# EAGLE board UltimateTester_v1_with_mods (EAGLE 9.6.2)
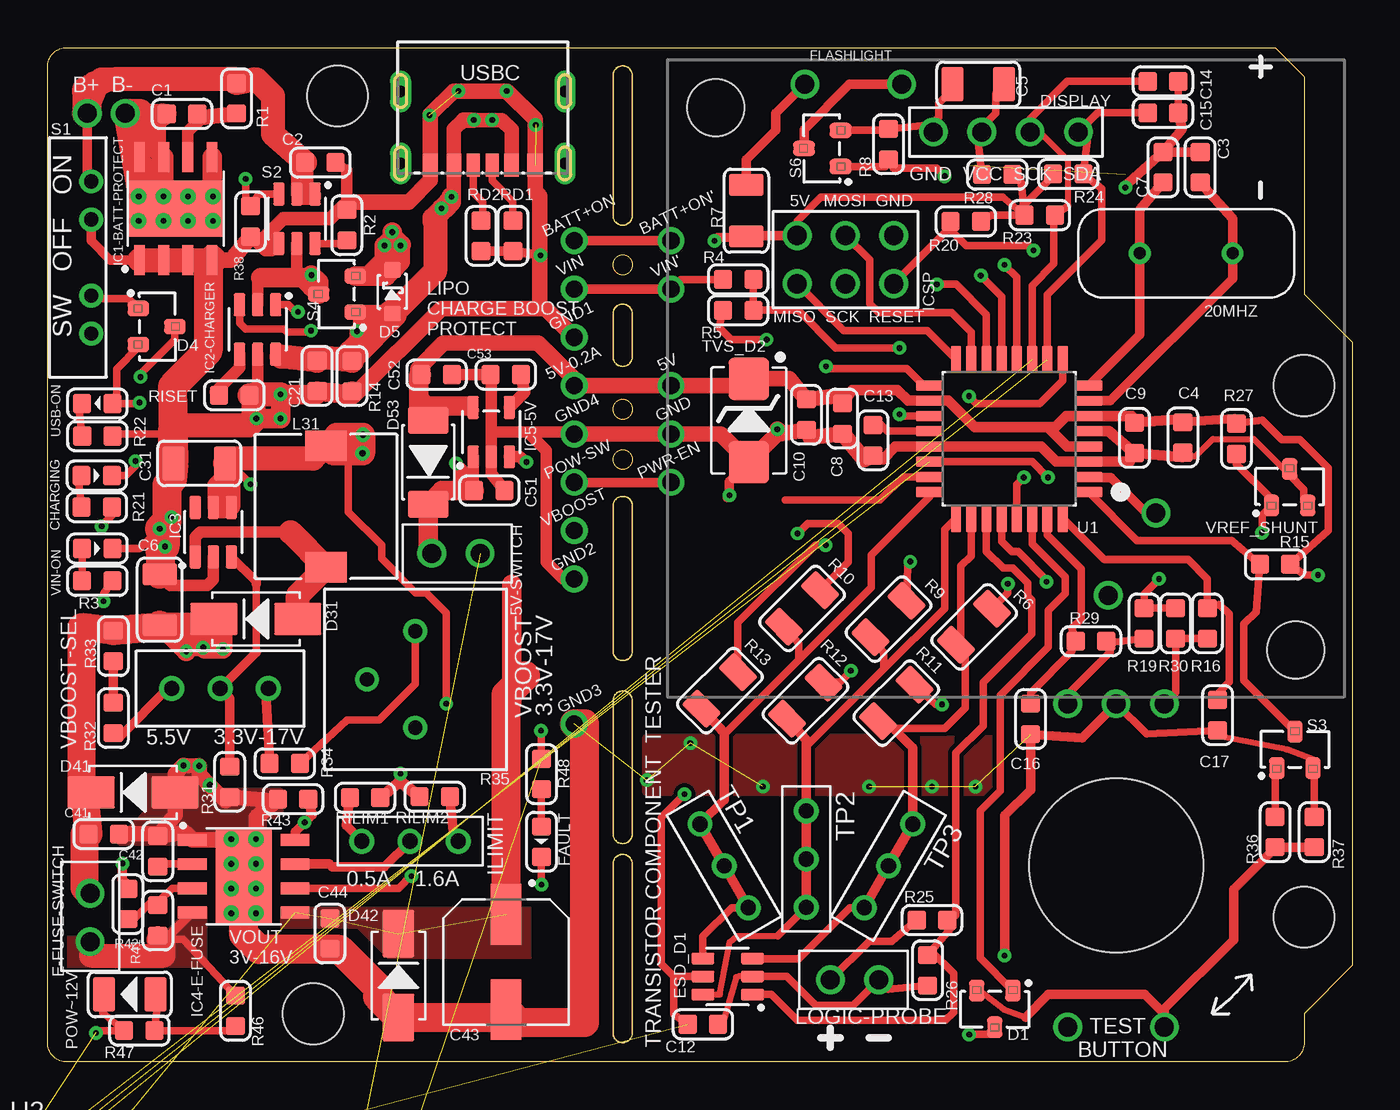
[diagram p1: board, top side]
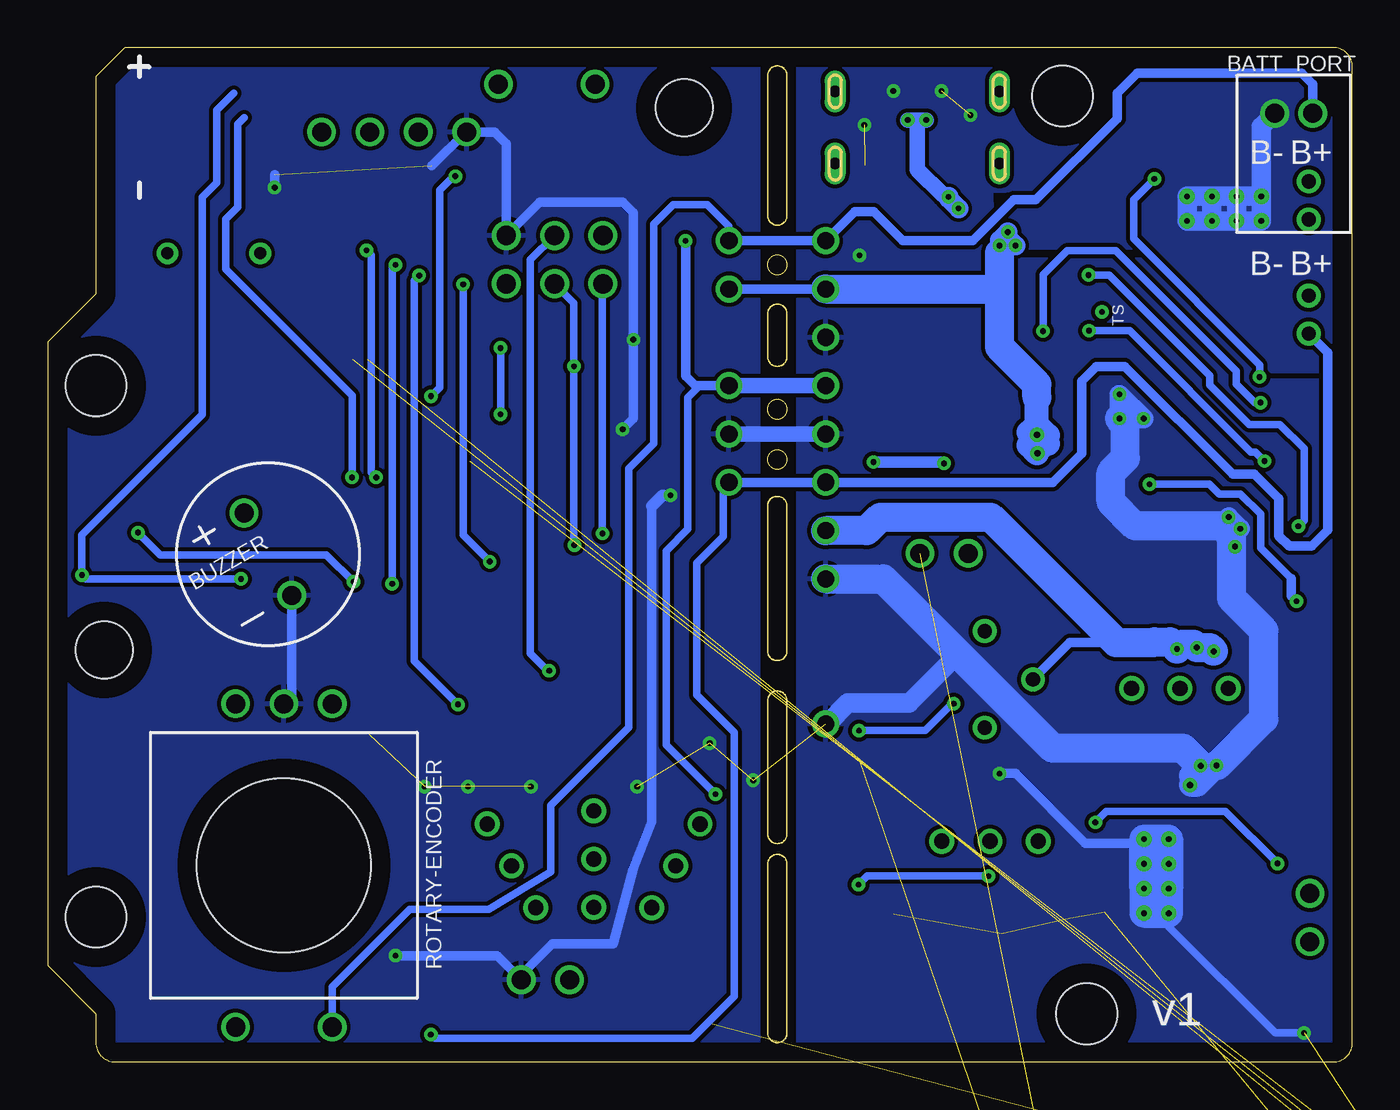
[diagram p2: board, bottom side, seen from below]

Size 68.58 x 53.34 mm. Coordinates in mm from the lower left corner, seen from the top.
Outline: 68.58,5.08 66.04,2.54 66.04,1.02 arc-90 65.02,0 1.02,0 arc-90 0,1.02 0,52.32 arc-90 1.02,53.34 64.52,53.34 66.04,51.82 66.04,40.39 68.58,37.85 68.58,5.08
Copper layers (1*16): Top 0.035mm / dielectric 1.5mm / Bottom 0.035mm
Design rules "default *": minimum track width 6mil, minimum drill 0.3mm, track to track 0.2mm, track to pad 0.2mm, pad to pad 0.2mm, via to via 10mil, smd to smd 0.2mm, copper to edge 40mil, drill to drill 0.5mm, minimum pad ring 10mil, minimum via ring 8mil, stop-mask expansion 4mil, vias tented up to drill 0mil, thermal gap 10mil
Net classes: 0 default: clearance 0.205 mm
Holes 3.2 mm at 15.24,50.8 13.97,2.54 66.04,7.62 66.04,35.56
tKeepout: area 13.2,48.8 to 17.2,52.8; area 12,0.5 to 16,4.5; area 64,5.6 to 68,9.6; area 64,33.6 to 68,37.6
bKeepout: area 13.2,48.8 to 17.2,52.8; area 12,0.5 to 16,4.5; area 64,5.6 to 68,9.6; area 64,33.6 to 68,37.6
Milling: area 29.7,33.8 to 30.7,34.8; area 29.7,31.2 to 30.7,32.2; area 29.7,41.4 to 30.7,42.4; 30 lines

## Footprints (pad centres in the part's own frame; a part is rotated, then mirrored left to right if it is on the bottom)
TEST-POINT-TH-1MM = drill 0.9: P$1 0,0
HEADER-2PIN-0.1"P = drill 1: 1 -1.27,0; 2 1.27,0
XTAL_ECS-200-18-4X-CKM = drill 0.63 pad 1.03: 1 -2.44,0; 2 2.44,0
S2B-PH-K-S = drill 1: N 0.984,-2.54; P -1.016,-2.54
BUZZER-ACTIVE-CMI-9605-0580T = drill 1: P$1 0,2.5; P$2 0,-2.5
0603 = smd 0.95 x 1: 1 -0.8,0; 2 0.8,0
1206 = smd 1.15 x 1.8: 1 -1.35,0; 2 1.35,0
CAP_EEEFN1E101UP = smd 3.2 x 1.6: 1 -2.5,0; 2 2.5,0
0603-DIODE = smd 0.95 x 1: A 0.8,0; C -0.8,0
SOT-23-3 = smd 0.8 x 1.13: 1 -0.95,-0.96; 2 0.95,-0.96; 3 0,0.96
SMA = smd 2.5 x 1.7: A -2.205,0; C 2.205,0
SOD-323 = smd 0.8 x 0.9: A -1.16,-0.03; C 1.14,-0.03
SOD-128 = smd 1.4 x 2.1: A -2.11,-0.06; K 2.29,-0.06
DISPLAY-1.3"-SH1106-I2C = drill 1: GND -3.81,-1.27; SCK 1.27,-1.27; SDA 3.81,-1.27; VCC -1.27,-1.27 | hole 3: -15.24,0; 15.24,-28.5
SOT-23-6 = smd 1.2 x 0.6: 1 -1.3,0.95; 2 -1.3,0; 3 -1.3,-0.95; 4 1.3,-0.95; 5 1.3,0; 6 1.3,0.95
HEADER-2PIN-0.2"P = drill 1: 1 -2.54,0; 2 2.54,0
SOIC-8-POWER-PAD = smd 1.55 x 0.6: 1 -2.7,1.905; 2 -2.7,0.635; 3 -2.7,-0.635; 4 -2.7,-1.905; 5 2.7,-1.905; 6 2.7,-0.635; 7 2.7,0.635; 8 2.7,1.905 | smd 2.95 x 4.9: 9 0,0 | drill 0.3: 10 -0.65,1.95; 11 0.65,1.95; 12 -0.65,0.65; 13 0.65,0.65; 14 -0.65,-0.65; 15 0.65,-0.65; 16 -0.65,-1.95; 17 0.65,-1.95
SOT-23-5 = smd 1.2 x 0.6: 1 -1.3,0.95; 2 -1.3,0; 3 -1.3,-0.95; 4 1.3,-0.95; 5 1.3,0.95
HEADER-ICSP-0.1"P = drill 1.016: GND 2.54,1.27; MISO -2.54,-1.27; MOSI 0,1.27; RESET 2.54,-1.27; SCK 0,-1.27; VCC -2.54,1.27
HEADER-3PIN-0.1"P = drill 0.8: 1 -2.54,0; 2 0,0; 3 2.54,0
AMPHENOL_87583-2010RLF = smd 1.12 x 2.88: 01 -3.5,3.58; 02 -1,3.58; 03 1,3.58; 04 3.5,3.58 | drill 2.36: S1 -6.57,0; S2 6.57,0
INDUCTOR-SMRH74-220MT = smd 2.2 x 1.6: P$1 0,3.2; P$2 0,-3.2
1206-DIODE = smd 1.15 x 1.8: A1 1.35,0; C1 -1.35,0
ROTARY-POTENTIOMETER-3386P = drill 0.75: 1 2.54,0; 2 0,-2.54; 3 -2.54,0
PEC12R-3217F-S0024 = drill 1: 1 -2.54,8.5; 2 2.54,8.5; A -2.54,-8.5; B 2.54,-8.5; C 0,-8.5 | hole 9.144: 0,0
CSS-1310MC = drill 0.75: 1 -4,0; 2 -2,0; 3 4,0; C 2,0
DIOM5336X244N = smd 2.22 x 2.13: A 2.19,0; C -2.19,0
TQFP32 = smd 1.47 x 0.55: 1 -4.17,2.8; 2 -4.17,2; 3 -4.17,1.2; 4 -4.17,0.4; 5 -4.17,-0.4; 6 -4.17,-1.2; 7 -4.17,-2; 8 -4.17,-2.8; 17 4.17,-2.8; 18 4.17,-2; 19 4.17,-1.2; 20 4.17,-0.4; 21 4.17,0.4; 22 4.17,1.2; 23 4.17,2; 24 4.17,2.8 | smd 0.55 x 1.47: 9 -2.8,-4.17; 10 -2,-4.17; 11 -1.2,-4.17; 12 -0.4,-4.17; 13 0.4,-4.17; 14 1.2,-4.17; 15 2,-4.17; 16 2.8,-4.17; 25 2.8,4.17; 26 2,4.17; 27 1.2,4.17; 28 0.4,4.17; 29 -0.4,4.17; 30 -1.2,4.17; 31 -2,4.17; 32 -2.8,4.17
SOP50P490X110-10N = smd 1.47 x 0.28: 1 -2.15,1; 2 -2.15,0.5; 3 -2.15,0; 4 -2.15,-0.5; 5 -2.15,-1; 6 2.15,-1; 7 2.15,-0.5; 8 2.15,0; 9 2.15,0.5; 10 2.15,1
USB-C-RECEPTABLE-1016435900011LF = smd 0.7 x 1.2: A5 -0.5,3.03; B5 0.5,3.03 | smd 0.76 x 1.2: A9 1.52,3.03; B9 -1.52,3.03 | smd 0.8 x 1.2: A12 2.75,3.03; B12 -2.75,3.03 | drill 0.6 pad 1.1 long: SH1 -4.32,2.95; SH2 4.32,2.95; SH3 -4.32,-0.85; SH4 4.32,-0.85
SLW-883935-2A-D = drill 0.8: 1 -2.54,0; 2 2.54,0; C 0,0

## Placement (x,y rotation side)
5V  TEST-POINT-TH  [TEST-POINT-TH-1MM]  32.77,35.56 0 top
5V-0.2A  TEST-POINT-TH  [TEST-POINT-TH-1MM]  27.69,35.56 70 top
5V-SWITCH  [HEADER-2PIN-0.1"P]  21.46,26.75 180 top
20MHZ  ECS-200-18-4X-CKM  [XTAL_ECS-200-18-4X-CKM]  59.84,42.52 0 top
BATT+ON  TEST-POINT-TH  [TEST-POINT-TH-1MM]  27.69,43.18 70 top
BATT+ON'  TEST-POINT-TH  [TEST-POINT-TH-1MM]  32.77,43.18 0 top
BATT_PORT  S2B-PH-K-S  [S2B-PH-K-S]  3.1,47.34 180 bottom
BUZZER  CMI-9605-0580T  [BUZZER-ACTIVE-CMI-9605-0580T]  57,26.7 30 bottom
C1  0.1uF  [0603]  7.07,49.85 180 top
C2  1uF  [0603]  14.33,47.29 180 top
C3  22pF  [0603]  60.58,47.04 270 top
C4  10uF  [0603]  59.66,32.84 270 top
C5  10uF  [1206]  48.92,51.41 180 top
C6  22uF-35V  [1206]  5.89,24.31 270 top
C7  22pF  [0603]  58.62,47.04 270 top
C8  100nF  [0603]  41.78,33.83 90 top
C9  100nF  [0603]  57.12,32.82 270 top
C10  10uF  [0603]  39.88,34.04 270 top
C11  22uF-15V  [1206]  -1.35,-118.03 0 top  (outside the outline)
C12  10uF  [0603]  34.44,1.98 0 top
C13  1nF  [0603]  43.38,32.69 270 top
C14  NC/10pF  [0603]  58.62,51.56 180 top
C15  NC/10pF  [0603]  58.62,49.91 180 top
C16  100nF  [0603]  51.66,18.03 270 top
C17  100nF  [0603]  61.49,18.24 270 top
C18  22uF-35V  [1206]  -1.35,-130.73 0 top  (outside the outline)
C21  1uF  [0603]  14.17,36.08 90 top
C31  22uF-15V  [1206]  7.98,31.47 0 top
C41  0.1uF  [0603]  2.95,11.99 180 top
C42  10nF  [0603]  5.79,11.07 270 top
C43  100uF  [CAP_EEEFN1E101UP]  24.1,5.26 270 top
C44  10uF  [0603]  14.83,6.76 90 top
C51  10uF-25V  [0603]  23.22,30.05 180 top
C52  10uF  [0603]  20.45,36.14 180 top
C53  10nFC0G  [0603]  24.08,36.14 0 top
CHARGING  BLUE  [0603-DIODE]  2.59,30.84 180 top
D1  PMBD6100,215  [SOT-23-3]  49.78,2.79 180 top
D2  SS34  [SMA]  -2.21,-143.43 0 top  (outside the outline)
D4  PMBD6100,215  [SOT-23-3]  5.73,38.67 270 top
D5  CUS10S30  [SOD-323]  18.09,40.51 90 top
D31  SS34  [SMA]  10.95,23.29 180 top
D41  SMAJ15A  [SMA]  4.5,14.17 180 top
D42  SS34  [SMA]  18.44,4.55 90 top
D53  PMEG3010EP  [SOD-128]  20.07,31.62 270 top
DISPLAY  [DISPLAY-1.3"-SH1106-I2C]  50.37,50.16 0 top
E-FUSE-SWITCH  [HEADER-2PIN-0.1"P]  2.24,7.59 270 top
ESD_D1  SRV05-4MR6  [SOT-23-6]  35.74,4.5 180 top
FAULT  RED  [0603-DIODE]  25.96,11.58 90 top
FLASHLIGHT  HEADER-2PIN-0.2"P  [HEADER-2PIN-0.2"P]  42.34,51.41 0 top
GND  TEST-POINT-TH  [TEST-POINT-TH-1MM]  32.77,33.02 0 top
GND1  TEST-POINT-TH  [TEST-POINT-TH-1MM]  27.69,38.1 70 top
GND2  TEST-POINT-TH  [TEST-POINT-TH-1MM]  27.69,25.4 70 top
GND3  TEST-POINT-TH  [TEST-POINT-TH-1MM]  27.69,17.78 70 top
GND4  TEST-POINT-TH  [TEST-POINT-TH-1MM]  27.69,33.02 70 top
IC1  MT3608  [SOT-23-6]  -1.3,-59.88 0 top  (outside the outline)
IC1-BATT-PROTECT  XB8089D  [SOIC-8-POWER-PAD]  6.74,44.87 90 top
IC2-CHARGER  BQ21040DB  [SOT-23-6]  11.04,38.52 270 top
IC3  MT3608  [SOT-23-6]  8.71,27.86 90 top
IC4-E-FUSE  TPS259630  [SOIC-8-POWER-PAD]  10.3,9.77 0 top
IC5-5V  LP2992IM5-5.0  [SOT-23-5]  23.32,33.12 90 top
ICSP  CES-103-01-T-D  [HEADER-ICSP-0.1"P]  41.94,42.19 0 top
ILIMIT  [HEADER-3PIN-0.1"P]  19.05,11.61 0 top
J1  USB-A-RECEPTABLE  [AMPHENOL_87583-2010RLF]  -14.99,-135.64 0 top  (outside the outline)
L1  22uH  [INDUCTOR-SMRH74-220MT]  0,-76.73 0 top  (outside the outline)
L31  22uH  [INDUCTOR-SMRH74-220MT]  14.63,29.21 0 top
LOGIC-PROBE  [HEADER-2PIN-0.1"P]  42.42,4.32 0 top
POW-SW  TEST-POINT-TH  [TEST-POINT-TH-1MM]  27.69,30.48 70 top
POW~12V  RED  [1206-DIODE]  4.32,3.56 0 top
PWR-EN  TEST-POINT-TH  [TEST-POINT-TH-1MM]  32.77,30.48 0 top
R1  1K  [0603]  9.94,50.67 90 top
R2  10K  [0603]  15.73,44 90 top
R3  4K7  [0603]  2.62,25.3 0 top
R4  10K  [0603]  36.3,41.15 0 top
R5  3K3  [0603]  36.3,39.52 180 top
R6  680  [1206]  48.69,22.89 225 top
R7  51  [1206]  36.73,44.75 90 top
R8  100K  [0603]  44.2,48.26 90 top
R9  680  [1206]  44.2,23.29 225 top
R10  680  [1206]  39.65,23.85 225 top
R11  470k  [1206]  44.6,18.87 225 top
R12  470k  [1206]  39.83,19 225 top
R13  470k  [1206]  35.33,19.53 225 top
R14  10K  [0603]  16,36.07 90 top
R15  100K  [0603]  64.52,26.16 180 top
R16  10K  [0603]  60.96,23.06 90 top
R17  20K  [0603]  -0.8,-92.63 0 top  (outside the outline)
R18  2.2K  [0603]  -0.8,-105.33 0 top  (outside the outline)
R19  10K  [0603]  57.63,23.06 90 top
R20  10K  [0603]  48.26,44.2 180 top
R21  1K  [0603]  2.59,29.18 0 top
R22  750  [0603]  2.62,32.91 180 top
R23  3.3K  [0603]  52.15,44.53 180 top
R24  3.3K  [0603]  53.64,46.69 180 top
R25  10K  [0603]  46.48,7.47 180 top
R26  3.3K  [0603]  46.25,4.83 90 top
R27  10K  [0603]  62.48,32.77 270 top
R28  68R  [0603]  49.91,46.66 0 top
R29  10K  [0603]  54.84,22.12 180 top
R30  10K  [0603]  59.28,23.06 90 top
R31  2.2K  [0603]  9.58,14.73 270 top
R32  18K  [0603]  3.45,18.08 270 top
R33  0  [0603]  3.45,21.87 270 top
R34  10K-1%  [0603]  12.47,15.7 180 top
R35  50K  [ROTARY-POTENTIOMETER-3386P]  19.33,20.12 270 top
R36  10K  [0603]  64.52,12.09 270 top
R37  22K  [0603]  66.57,12.09 270 top
R38  7K5  [0603]  10.67,44.2 90 top
R41  82K5  [0603]  5.79,7.44 270 top
R42  38K3  [0603]  4.22,8.31 270 top
R43  10K  [0603]  12.9,13.82 0 top
R46  3K3  [0603]  9.88,2.69 90 top
R47  1K  [0603]  4.83,1.65 0 top
R48  470  [0603]  25.96,15.14 90 top
RD1  5K1-1%  [0603]  24.46,43.43 90 top
RD2  5K1-1%  [0603]  22.78,43.43 90 top
RILIM1  1K8-1%  [0603]  16.69,13.89 180 top
RILIM2  560-1%  [0603]  20.35,13.94 0 top
RISET  1K5-0.36A  [0603]  9.81,35.06 0 top
ROTARY-ENCODER  PEC12R-3217F-S0024  [PEC12R-3217F-S0024]  56.16,10.34 180 top
S1  POWER-SWITCH  [CSS-1310MC]  2.29,42.3 270 top
S2  TPS22995H  [SOT-23-6]  13.11,44.34 270 top
S3  BC847C  [SOT-23-3]  65.56,16.41 0 top
S4  DMP1045U  [SOT-23-3]  15.21,40.38 90 top
S6  AS2312  [SOT-23-3]  40.72,48.03 90 top
TP1  [HEADER-3PIN-0.1"P]  35.56,10.31 300 top
TP2  [HEADER-3PIN-0.1"P]  39.88,10.67 270 top
TP3  [HEADER-3PIN-0.1"P]  44.2,10.31 240 top
TVS_D2  SMBJP6KE6.8A  [DIOM5336X244N]  36.86,33.73 270 top
U1  ATMEGA328P-AU-TQFP  [TQFP32]  50.55,32.77 180 top
U2  INA226AIDGST  [SOP50P490X110-10N]  1.02,-5.08 0 top  (outside the outline)
USB-ON  ORANGE  [0603-DIODE]  2.62,34.62 0 top
USBC  10164359-00011LF  [USB-C-RECEPTABLE-1016435900011LF]  22.87,50.19 180 top
VBOOST  TEST-POINT-TH  [TEST-POINT-TH-1MM]  27.69,27.94 70 top
VBOOST-SEL  [SLW-883935-2A-D]  9.07,19.63 0 top
VIN  TEST-POINT-TH  [TEST-POINT-TH-1MM]  27.69,40.64 70 top
VIN'  TEST-POINT-TH  [TEST-POINT-TH-1MM]  32.77,40.64 0 top
VIN-ON  GREEN  [0603-DIODE]  2.62,27 180 top
VOUT  TEST-POINT-TH  [TEST-POINT-TH-1MM]  0,-46.23 0 top  (outside the outline)
VREF_SHUNT  LM4040AELT-2.5  [SOT-23-3]  65.28,30.23 0 top

## Tracks (layer width: path | path; a pad name or v marks a point on that pad's centre or on a via)
5V  (via drill 0.3)  (1 unrouted)
  Top 0.406: R23.2 51.15,44.91 52.65,46.41 R24.2 | R28.2 51.15,46.42 R23.2 | R23.2 50.21,45.47 40.64,45.47 39.4,44.22 ICSP.VCC | R30.2 R19.2 57.63,24.61 v58.42,25.4 | R27.1 63.85,33.77 64.87,32.74 65.81,32.74 67.31,31.24 67.31,27.96 R15.1 66.08,25.6 v66.77,25.6 | R20.1 49.59,44.53 R23.2 | v33.48,14.09 32.26,12.87 32.26,5.16 32.92,4.5 | ESD_D1.5 32.92,4.5 | C12.1 32.92,2.5 32.92,4.5
  Top 0.508: 59.64,33.82 C4.1 62.41,33.84 R27.1 | D53.A 20.56,34.29 | 22.37,34.29 IC5-5V.5 22.09,34.7 | C52.2 19.45,35.24 | v35.05,43.18 35.2,43.33 R7.1 36.85,43.46 ICSP.VCC
  Top 0.559: C8.2 42.29,35.34 44.67,35.34 45.24,34.77 U1.18 47.35,34.77 48.72,33.39 52.58,33.39 | 59.64,33.82 C9.1 56.98,33.97 U1.6 53.55,33.97 52.97,33.39 52.58,33.39 | 52.58,33.39 53.6,32.37 U1.4
  Top 0.61: 20.56,34.29 22.37,34.29 | 22.09,34.7 19.98,34.7 19.45,35.24
  Top 0.813: C8.2 41.58,35.04 C10.1 38.99,35.92 TVS_D2.C 36.49,35.56 5V.P$1 5V-0.2A.P$1 27.94,35.64 25.78,37.8 20.8,37.8 19.45,36.44 C52.2 | D53.A 19.5,34.24
  Top 1.016: 19.5,34.24 19.5,36.09 C52.2
  Bottom 0.406: v58.42,25.4 66.57,25.4 v66.77,25.6 66.77,27.71 60.45,34.04 60.45,45.47 59.69,46.23 59.69,50.04 58.8,50.93 | 5V.P$1 34.29,35.56 34.92,34.92 34.92,28.02 36.07,26.87 36.07,16.68 v33.48,14.09
  Bottom 0.508: v35.05,43.18 35.05,36.07 34.54,35.56 5V.P$1
  Bottom 0.813: 5V-0.2A.P$1 5V.P$1
!FLT  (via drill 0.3)
  Top 0.406: v19.13,9.78 19.1,9.78 18.46,9.13 IC4-E-FUSE.6 | FAULT.C v25.96,9.32
  Bottom 0.406: v19.13,9.78 25.5,9.78 v25.96,9.32
+VE
  Top 0.406: LOGIC-PROBE.1 43.18,6.35 44.36,6.35 R25.2
A
  Top 0.406: ROTARY-ENCODER.A 59.28,19.42 R30.1 R16.1
ADC7_(NOT_USED)  (via drill 0.3)  (1 unrouted)
  Top 0.406: U1.22 51.75,31.57 v52.58,30.73
  Bottom 0.406: v52.58,30.73 52.58,35.05 59.21,41.68 59.21,44.32 58.59,44.94 58.59,49.3 58.23,49.66
AREF
  Top 0.406: U1.20 44.14,33.17 43.61,33.69 C13.1
B
  Top 0.406: ROTARY-ENCODER.B 53.62,19.33 55.84,21.55 R29.1 55.9,22.06 R19.1
BATT+  (via drill 0.3)
  Top 0.406: v2.85,28.17 2.85,28.21 3.59,28.95 R21.2
  Top 0.61: 12.85,41.25 13.11,41.5 S2.5 13.11,41.38 v13.87,41.38 | 11.2,41.25 11.04,41.09 IC2-CHARGER.2
  Top 1.016: S4.3 13.87,40.76 v13.87,41.38 | v13.87,41.38 13.74,41.25 13.38,41.25 | 13.38,41.25 12.85,41.25 11.2,41.25 | S4.3 13.38,41.25 | v13.87,41.38 14.25,41 S4.3
  Bottom 0.406: v13.87,41.38 12.78,41.38 7.49,36.09 7.49,35.59 5.44,33.53 3.81,33.53 2.54,32.26 2.54,28.47 v2.85,28.17
BATT-
  Top 0.406: 6.1,45.53 6.74,44.9 IC1-BATT-PROTECT.9 7.43,45.56 8.64,45.56
  Top 1.016: 6.04,49.88 C1.2 | C1.2 5.71,49.5 5.71,47.96 IC1-BATT-PROTECT.7 | IC1-BATT-PROTECT.8 4.83,47.42 5.44,46.81 6.1,47.47 IC1-BATT-PROTECT.7 | 6.59,45.26 6.1,45.26 6.1,45.53 | IC1-BATT-PROTECT.7 6.1,45.53 | 6.1,45.53 IC1-BATT-PROTECT.13 | IC1-BATT-PROTECT.11 4.83,45.56 IC1-BATT-PROTECT.8 | IC1-BATT-PROTECT.8 4.83,49.88 C1.2 | IC1-BATT-PROTECT.5 8.64,45.56 IC1-BATT-PROTECT.17 | IC1-BATT-PROTECT.9 7.13,45.26
  Top 1.27: BATT_PORT.N 4.83,45.56
  Top 1.524: BATT_PORT.N 4.83,49.88
  Bottom 1.016: BATT_PORT.N 4.79,49.18 IC1-BATT-PROTECT.11 | IC1-BATT-PROTECT.11 IC1-BATT-PROTECT.13 | IC1-BATT-PROTECT.13 IC1-BATT-PROTECT.15 | IC1-BATT-PROTECT.15 IC1-BATT-PROTECT.17 IC1-BATT-PROTECT.16 IC1-BATT-PROTECT.14 | IC1-BATT-PROTECT.14 IC1-BATT-PROTECT.15 | IC1-BATT-PROTECT.14 IC1-BATT-PROTECT.12 | IC1-BATT-PROTECT.12 IC1-BATT-PROTECT.10 IC1-BATT-PROTECT.11 | IC1-BATT-PROTECT.13 IC1-BATT-PROTECT.12
  pour Bottom (no thermals): -0.2,54.15 -0.2,36.25 4.27,36.25 10.77,42.75 17.91,42.75 18.06,42.9 18.06,45.26 16.46,45.26 12.37,49.35 12.37,54.36 0,54.36
BATT_EN  (via drill 0.3)
  Top 0.406: D4.3 6.7,37.98 4.88,36.16 v4.88,36.02 | S2.3 11.11,45.64 R38.2 10.41,45.45 v10.41,46.43
  Bottom 0.406: v10.41,46.43 11.51,45.34 11.51,43.28 4.88,36.65 v4.88,36.02
BATTP_ALWAYS_ON
  Top 0.508: BATT_PORT.P 2.08,46.51 S1.1 | BATT+ON.P$1 BATT+ON'.P$1
  Top 0.61: S2.2 13.11,47.07 C2.2 | C2.2 13.64,47.29 13.69,47.24 13.69,45.85 13.9,45.64 S2.1 14.06,45.44 13.98,45.36 13.3,45.36 13.3,47.27 C2.2
  Top 1.016: 9.93,51.66 R1.2 | 3.51,51.66 2.06,51 | BATT_PORT.P 2.75,51.46 2.84,51.66
  Top 1.27: 2.06,51.08 2.44,51.46 2.75,51.46 | 2.84,51.66 3.51,51.66 9.93,51.66 | R1.2 10.97,51.67 11.84,50.8 11.84,48.78 C2.2
  Top 1.524: BATT_PORT.P 2.06,49.91 2.06,51 2.06,51.08
  Bottom 0.406: BATT+ON'.P$1 32.77,43.94 33.91,45.09 35.69,45.09 36.73,44.04 36.73,32.51 38.02,31.22 38.02,17.6 42.14,13.49 42.14,10.01 45.39,8.03 49.53,8.03 53.62,3.94 ROTARY-ENCODER.2
  Bottom 0.508: BATT_PORT.P 2.08,51.42 2.67,52 11.3,52 12.37,50.94 12.37,49.61 16.64,45.34 17.8,45.34 19.96,43.18 23.62,43.18 25.15,44.7 26.16,44.7 BATT+ON.P$1 BATT+ON'.P$1
BJT-B
  Top 0.406: R36.1 64.52,15.36 S3.1
BUZZER
  Top 0.508: U1.2 54.75,30.73 55.88,30.73 57.75,28.86 BUZZER.P$1
BYP1
  Top 0.61: IC5-5V.4 25.08,35.23 C53.2
CHG  (via drill 0.3)
  Top 0.406: IC2-CHARGER.3 10.09,38.86 10.41,38.53 12.45,38.53 12.6,38.37 13.76,38.37 v13.84,38.46 | CHARGING.C 4.1,30.84 4.62,31.36 v4.62,31.6
  Bottom 0.406: v13.84,38.46 11.71,38.46 5.33,32.08 5.11,32.08 v4.62,31.6
DISPLAY_VCC
  Top 0.406: R28.1 48.91,48.38 49.1,48.56 DISPLAY.VCC 49.1,49.15 49.84,49.89 49.84,50.9 C5.1
DVDT
  Top 0.406: C42.2 6.12,10.4 IC4-E-FUSE.2
EN/UVLO
  Top 0.406: IC4-E-FUSE.3 6.54,9.13 5.85,8.44 R41.1 5.49,8.44 4.35,7.31 R42.2
ENC_A
  Top 0.406: C17.1 61.49,19.36 62.1,19.97 62.1,23.55 61.59,24.06 R16.2 60.96,25.4 59.94,26.42 55.53,26.42 U1.32
ENC_B
  Top 0.406: U1.31 52.55,27.72 54.33,25.93 54.33,23.3 53.84,22.81 R29.2 53.84,21.58 51.66,19.41 C16.1
FB
  Top 0.406: 10.97,25.15 10.97,21.54
  Top 0.508: R31.1 9.58,19.13 VBOOST-SEL.C 10.97,21.54 | IC3.3 10.97,25.25 10.97,25.15
FB2  (2 unrouted)
FL+
  Top 0.508: FLASHLIGHT.1 38.28,49.89 38.28,48.99 36.73,47.44 R7.2
FL-
  Top 0.508: S6.3 39.76,49.03 42.14,51.41 FLASHLIGHT.2
FLASHLIGHT  (via drill 0.3)
  Top 0.305: 53.34,35.81 53.35,35.82
  Top 0.406: S6.1 44.02,47.08 R8.1 44.45,47.01 46.72,47.01 v47.15,46.58 | v48.42,35.01 48.81,34.62 52.15,34.62 53.34,35.81 | 53.35,35.82 U1.9
  Bottom 0.406: v47.15,46.58 47.24,46.58 47.97,45.85 47.97,35.47 v48.42,35.01
GND  (via drill 0.3, 0.35)  (17 unrouted)
  Top 0.305: C4.2 60.33,31.84 61.25,32.77 63.39,32.77 64.97,31.19 VREF_SHUNT.3 | ESD_D1.2 36.3,4.5 36.19,4.46 35.52,2.11 C12.2 | S3.2 66.51,15.91 65.13,16.43 61.62,17.11 C17.2
  Top 0.406: R22.1 3.72,33.01 6.21,33.01 6.55,32.66 C31.1 | C5.2 47.5,51.09 46.83,50.42 46.83,49.67 46.56,49.4 DISPLAY.GND 46.19,49.26 R8.2 43.92,48.98 S6.2 | C14.1 C15.1 | VREF_SHUNT.2 66.03,29.47 66.03,30.11 65.28,30.86 VREF_SHUNT.3 | ROTARY-ENCODER.C 57.76,17.24 C17.2 | ESD_D1.2 38.86,4.5 40.39,2.97 42.34,2.97 LOGIC-PROBE.2 44.18,3.83 R26.1 | POW~12V.C1 2.9,2.58 R47.1 2.67,1.65 v2.54,1.52 | R5.2 35.3,38.62 35.93,37.98 v37.8,37.98 | VIN-ON.C 4.85,27 v5.89,28.04 | R37.1 66.57,15.38 S3.2
  Top 0.508: S1.2 2.29,43.17 3.3,42.17 IC1-BATT-PROTECT.1 | 59.64,31.82 C4.2 | 56.87,31.57 C9.2 | v50.29,5.59 50.32,5.61 50.32,12.96 51.66,14.31 C16.2 54.37,17.03 ROTARY-ENCODER.C | 5.89,25.6 C6.1 | 15.73,46.89 C2.1 | RD1.1 25.86,42.43 | RD1.1 RD2.1 | 35.73,29.68 v35.84,29.79 35.84,30.52 TVS_D2.A | C7.1 C3.1 | C7.1 59.62,49.04 C15.1 | v56.64,45.97 56.6,46.02 C7.1 | RD1.1 25.89,42.43 v25.91,42.42
  Top 0.559: U1.5 55.77,33.17 C9.2 59.64,31.82 | 56.87,31.57 U1.3 53.02,31.57 52.22,32.37 U1.21 44.56,32.37 43.88,31.69 C13.2
  Top 0.61: IC2-CHARGER.5 11.04,35.28 10.83,35.08 | IC3.2 8.71,25.38 8.38,25.04 6.45,25.04 5.89,25.6 | C51.1 23.32,30.95 IC5-5V.2 23.32,33.12 | GND2.P$1 27.1,25.4 26.21,26.29 26.21,32.16 25.25,33.12 | RILIM1.1 18.54,14.75 | 18.54,14.75 v18.54,15.16 | RILIM2.1 18.54,14.75 | 23.32,33.12 25.25,33.12 | 25.25,33.12 27.84,33.12 GND4.P$1 | R2.2 15.73,46.89 | 23.32,33.12 23.32,35.91 C53.1 C52.1 | S2.4 12,43.2 R38.1 10.91,43.2 11.43,42.67 11.79,42.67 S2.4
  Top 0.711: R38.1 11.24,43.2 12.39,44.35 14.85,44.35 15.5,45 R2.2
  Top 0.762: 6.55,33.22 6.81,33.48
  Top 0.813: C13.2 42.93,31.69 C8.1 40.08,32.83 C10.2 38.59,33.04 v38.35,33.27 38.35,33.04 TVS_D2.A 35.38,33.02 GND.P$1 GND4.P$1 | GND1.P$1 27.71,38.1 26.19,39.62 25.86,39.62 | 25.86,39.62 25.86,42.43 25.86,45.52 25.62,45.75 USBC.B12 25.62,49.56 v24.13,51.05 v21.59,51.05 21.34,51.05 20.12,49.84 USBC.A12 20.12,46.36 18.97,45.21 15.94,45.21 R2.2 | R14.1 16.13,35.07 20.68,39.62 25.86,39.62 | IC4-E-FUSE.11 10.96,12.87 R43.1 11.82,13.73 R31.2 9.36,13.73 v8.53,14.55 7.98,15.11 v7.98,15.57 v7.14,15.6 6.7,15.16 D41.A 6.7,12.98 C42.1 | C41.1 5.71,11.99 C42.1 | C42.1 7.21,12.07 IC4-E-FUSE.1 9.61,11.68 IC4-E-FUSE.10 | IC1-BATT-PROTECT.4 9.64,42.17 R38.1
  Top 1.016: IC4-E-FUSE.9 IC4-E-FUSE.14 | 10.3,8.47 IC4-E-FUSE.16 | 11.1,5.92 11.26,5.76 C44.1 14.99,5.92 15.37,5.92 | v10.97,33.83 v12.24,33.83 v12.24,35.1 14.15,35.1 C21.1 15.99,35.08 R14.1
  Top 1.27: IC1-BATT-PROTECT.1 IC1-BATT-PROTECT.2 IC1-BATT-PROTECT.3 IC1-BATT-PROTECT.4 | 10.83,35.08 RISET.2 | 6.81,33.48 10.62,33.48 v10.97,33.83 10.83,33.98 10.83,35.08 | v12.24,35.1 10.86,35.1 10.83,35.08
  Top 1.524: IC1-BATT-PROTECT.4 8.44,41.97 8.44,37.4 6.55,35.51 C31.1 | C31.1 6.55,33.22 | C31.1 6.55,30.63 6.27,30.35 6.27,28.42 v5.89,28.04 6.17,27.76 v6.17,27.1 5.92,26.85 5.92,25.75 C6.1 | GND3.P$1 28.23,17.78 28.23,2.07 24.79,2.07 C43.2 23.69,2.34 D42.A 17.35,3.43 17.35,3.94 15.37,5.92 11.1,5.92 10.3,6.71 10.3,8.47 IC4-E-FUSE.15
  Bottom 0.406: v2.54,1.52 4.06,1.52 9.65,7.12 IC4-E-FUSE.16
  Bottom 0.508: IC4-E-FUSE.11 11.18,11.49 14.03,11.49 17.7,15.16 v18.54,15.16 | v38.35,33.27 37.8,33.83 v37.8,37.98 37.8,44.65 38.35,45.21 42.72,45.21 ICSP.GND 44.48,48.28 45.09,48.9 DISPLAY.GND 46.61,48.9 48.39,47.12 | ROTARY-ENCODER.C 56.16,18.82 55.75,19.23 BUZZER.P$2 | 36.83,29.23 36.83,12.63 37.8,10.16 38.86,6.22 42.05,6.22 43.69,4.59 LOGIC-PROBE.2 44.96,5.59 v50.29,5.59 | v56.64,45.97 56.64,46.67
  Bottom 0.61: v35.84,29.79 36.27,29.79 36.83,29.23
  Bottom 0.813: GND4.P$1 GND.P$1
  Bottom 1.016: 6.6,27.69 6.6,28.19 6.6,28.55 v6.5,28.65 v5.89,28.04 6.17,27.76 v6.17,27.1 6.68,27.61 6.6,27.69 | 6.6,27.69 6.35,27.94 | 11.94,33.53 11.63,33.83 v10.97,33.83 v12.24,35.1 v12.24,33.83 | 20.71,21.45 23.29,18.87 26.52,18.87 27.61,17.78 GND3.P$1
  Bottom 1.27: v7.98,15.57 8.48,15.06 8.48,14.58 8.15,14.58 v7.14,15.6
  Bottom 1.524: v7.14,15.6 7.11,15.57 4.65,18.03 4.65,22.68 6.35,24.38 6.35,27.94 | v7.98,15.57 8.91,16.51 15.77,16.51 20.71,21.45 24.66,25.4 GND2.P$1 | IC4-E-FUSE.14 IC4-E-FUSE.16 IC4-E-FUSE.17 IC4-E-FUSE.15 | IC4-E-FUSE.14 IC4-E-FUSE.15 | IC4-E-FUSE.15 IC4-E-FUSE.13 | IC4-E-FUSE.13 IC4-E-FUSE.11 IC4-E-FUSE.10 IC4-E-FUSE.12 | IC4-E-FUSE.12 IC4-E-FUSE.13 | IC4-E-FUSE.12 IC4-E-FUSE.14 | v12.24,33.83 11.94,33.53 11.94,31.75 12.7,30.99 12.7,29.46 11.43,28.19 6.6,28.19
  other vias: 31.5,14.81 33.78,16.76 37.59,14.48 43.18,14.48 46.48,14.48 48.77,14.48 20.07,49.78 25.65,49.28
  pour Bottom: 29.21,54.36 29.21,-1.27 28.96,-1.52 -0.51,-1.52 -1.02,-1.02 -1.02,35.87 4.35,35.87 10.72,42.24 18.62,42.24 18.84,42.46 18.9,45.75 16.81,45.8 12.88,49.73 12.88,54.36
  pour Bottom: 31.17,54.13 31.17,0.33 32.51,-1.02 68.58,-1.02 69.34,-0.25 69.34,52.83 68.05,54.13
  pour Top (no thermals): 3.81,12.19 4.32,12.19 5.33,13.21 5.33,14.99 6.35,14.99 6.6,15.24 7.87,15.24 7.87,14.99 8.64,14.22 12.19,14.22 12.19,13.21 11.94,12.95 11.33,12.95 11.33,11.58 3.81,11.58
  pour Top: 31.5,17.02 31.5,14.48 49.78,14.48 49.78,17.02
  pour Top: 31.5,17.02 31.5,14.22 50.04,14.22 50.04,17.02
I2C-SCL  (1 unrouted)
  Top 0.305: 52.15,48.9 53.62,47.42 53.62,45
  Top 0.406: 52.15,48.9 DISPLAY.SCK 51.64,49.61 53.59,51.56 C14.2 | 53.62,45 R23.1 52.89,44.27 52.89,41.97 51.75,40.82 U1.11
I2C-SDA  (1 unrouted)
  Top 0.406: C15.2 55.19,49.91 DISPLAY.SDA 54.65,48.43 R24.1 55.41,45.92 55.41,43.22 52.55,40.35 U1.10
ILM
  Top 0.508: ILIMIT.2 17.7,10.25 14.96,10.25 14.81,10.4 IC4-E-FUSE.7
ILM1
  Top 0.508: ILIMIT.1 15.69,12.43 RILIM1.2
ILM2
  Top 0.508: RILIM2.2 21.34,11.85 ILIMIT.3
ISET
  Top 0.61: RISET.1 8.81,35.23 10.09,36.5 IC2-CHARGER.4
N$1
  Top 0.406: USBC.B5 22.37,45.7 22.86,45.21 22.86,44.51 RD2.2
N$2
  Top 0.406: USBC.A5 23.37,46.33 24.46,45.24 RD1.2
N$3
  Top 0.406: USB-ON.C 1.62,34.62 R22.2
N$4
  Top 0.508: R32.2 3.79,17.1 6.33,19.63 VBOOST-SEL.1
N$5
  Top 0.406: R3.1 VIN-ON.A
N$7
  Top 0.406: R48.1 FAULT.A
N$10
  Top 0.406: CHARGING.A 1.59,30.83 R21.1
N$12
  Top 0.508: R32.1 R33.2
N$13
  Top 0.508: R34.2 11.47,19.5 VBOOST-SEL.2
N$18
  Top 0.406: POW~12V.A1 5.83,3.47 R47.2 9.84,1.65 R46.1
N$21
  Top 0.406: R34.1 15.76,17.98 17.42,17.98 19.33,19.89 R35.3
OVLO  (via drill 0.3)
  Top 0.406: R42.1 4.22,9.31
  Top 0.508: v3.94,10.44 3.94,9.59 4.22,9.31 | IC4-E-FUSE.8 13.01,12.09 v13.51,12.6 13.9,12.99 R43.2
  Bottom 0.406: v3.94,10.44 6.68,13.18 12.93,13.18 v13.51,12.6
PC0_(NOT_USED)
  Top 0.406: U1.23 44.97,30.77 43.74,29.54 38.77,29.54
POWER_EN_SOFT  (via drill 0.3)
  Top 0.406: v48.44,1.45 49.45,1.45 49.45,1.5 D1.3
  Top 0.508: POW-SW.P$1 PWR-EN.P$1
  Bottom 0.406: PWR-EN.P$1 33.07,30.18 33.07,27.64 34.47,26.24 34.47,19.3 32.49,17.32 32.49,3.46 34.71,1.24 48.23,1.24 v48.44,1.45
  Bottom 0.508: S1.3 1.29,37.31 1.29,27.96 2.13,27.13 3.33,27.13 3.86,27.66 3.86,29.62 5.16,30.91 6.3,30.91 11.96,36.58 13.46,36.58 14.22,35.81 14.22,32 15.75,30.48 POW-SW.P$1 PWR-EN.P$1
POWER_EN_TB
  Top 0.305: D1.2 49,3.75 50.27,2.77 51.4,2.35
  Top 0.508: R37.2 R36.2 64.35,11.09 62.33,9.07 62.33,6.43 58.7,2.79 ROTARY-ENCODER.1 58.7,2.52 57.67,3.56 52.6,3.56 51.4,2.35
PWR_CTRL
  Top 0.406: U1.30 51.75,27.25 53.49,25.5 53.49,24.64 52.6,23.75 52.6,21.82 50.06,19.28 50.06,14.25 49.02,13.21 49.02,5.47 D1.1
PWR_SW
  Top 0.406: D4.1 4.27,40.13 2.47,40.13 S1.C
RESET  (via drill 0.3)
  Top 0.406: ICSP.RESET 47.26,43.7 R20.2 47.26,43.94 48.28,42.93 51.56,42.93 v51.82,42.67 | v51.31,30.73 50.95,30.37 U1.29
  Bottom 0.406: v51.82,42.67 51.56,42.42 51.56,30.99 v51.31,30.73
RT
  Top 0.406: R2.1 15.69,43.04 S2.6
SW
  Top 0.61: IC3.1 7.76,27.61 8.02,27.86 12.78,27.86
  Top 1.27: 12.78,27.86 L31.P$2 13.15,24.53 D31.A
SW2  (2 unrouted)
TEST_BUTTON
  Top 0.406: U1.1 57.25,27.43 62.25,27.43 R15.2 63.52,23.67 62.86,23.02 62.86,20.06 S3.3
TP1
  Top 0.406: R10.2 39.48,22.01 39.48,21.14 | 39.48,21.14 43.28,24.94 43.28,26.64 46.38,29.74 U1.24 | ESD_D1.4 34.44,6.6 35.95,8.11 TP1.3 | 39.48,21.14 35.56,17.22
  Top 0.508: TP1.3 TP1.2 TP1.1 35.56,13.78 35.56,17.22 35.56,17.29 R13.2
TP1_470K/SCK  (via drill 0.3)
  Top 0.406: R13.1 36.29,20.59 36.29,23.1 40.36,27.18 v40.89,27.18 | U1.17 46.05,35.57 45.16,36.45 41.05,36.45 v40.92,36.58
  Bottom 0.406: ICSP.SCK 40.92,39.9 v40.92,36.58 40.92,27.2 v40.89,27.18
TP1_680/MISO  (via drill 0.3)
  Top 0.406: U1.16 46.22,38.46 41.85,38.46 ICSP.MISO | v39.42,27.79 39.95,28.32 41.55,28.32 42.08,27.8 42.08,26.28 R10.1
  Bottom 0.406: ICSP.MISO 39.42,40.89 v39.42,27.79
TP2
  Top 0.305: 38.38,6.63 36.25,6.63 35.85,6.3 35.34,3.55 ESD_D1.6
  Top 0.406: R9.2 43.95,21.52 43.95,20.66 | 43.95,20.66 47.14,23.85 47.14,27.99 U1.25 | 38.38,6.63 TP2.3 | 43.95,20.66 39.88,16.59
  Top 0.508: TP2.3 TP2.2 TP2.1 39.88,16.59 39.88,16.94 R12.2
TP2_470K/MOSI  (via drill 0.3)
  Top 0.406: U1.15 48.55,38.37 47.52,39.4 43.69,39.4 43.2,39.88 43.2,42.19 ICSP.MOSI | v42.22,20.57 42.22,20.52 41.7,20 R12.1
  Bottom 0.406: ICSP.MOSI 43.2,42.19 43.2,21.49 42.29,20.57 v42.22,20.57
TP2_680/SIGNAL_OUT  (via drill 0.3)
  Top 0.406: v45.34,26.31 45.2,26.18 R9.1 | v46.74,40.89 47.75,40.89 49.35,39.3 U1.14
  Bottom 0.406: v46.74,40.89 46.74,27.71 v45.34,26.31
TP3
  Top 0.406: U1.26 48.55,26.61 48.01,26.07 48.01,22.2 R6.2 48.22,21.35 48.22,18.6 47.14,17.53 44.45,17.53 | TP3.3 42.15,8.11 39.47,5.44 37.05,5.44 ESD_D1.3
  Top 0.508: TP3.3 TP3.2 TP3.1 45.47,16.51 44.45,17.53 44.11,17.87 R11.2
TP3_470K  (via drill 0.3)
  Top 0.406: R11.1 46.69,18.8 v47.02,18.8 | v49.05,41.35 50.15,40.25 U1.13
  Bottom 0.406: v47.02,18.8 49.3,21.08 49.3,41.1 v49.05,41.35
TP3_680  (via drill 0.3)
  Top 0.406: R6.1 50.47,24.66 v50.47,25.15 | v50.29,41.91 50.95,41.26 U1.12
  Bottom 0.406: v50.29,41.91 50.39,41.91 50.47,41.83 v50.47,25.15
TP_LOGIC
  Top 0.406: U1.27 49.35,26.85 50.22,25.98 50.72,25.98 51.51,25.2 51.51,24.51 51.71,24.3 51.71,22.5 49.17,19.96 49.17,17.68 47.74,16.24 47.74,7.72 R25.1 47.48,7.05 R26.2 46.46,5.83 47.62,4.66 47.62,2.62 47.19,2.18 39.4,2.18 38.03,3.55 ESD_D1.1
TS  (via drill 0.3)
  Top 0.406: IC2-CHARGER.1 12.66,39.82 13.03,39.45 v13.16,39.45
USBV  (via drill 0.3)
  Top 0.406: D4.2 4.78,37.58 3.63,36.44 3.63,34.64 USB-ON.A 4.78,34.62 v4.83,34.67
  Top 0.61: IC2-CHARGER.6 12.03,37.18 12.19,37.18
  Top 0.762: 21.84,49.53 21.35,49.04 USBC.A9 21.35,45.62 v21.22,45.49 | v22.4,49.53 v23.37,49.53 23.88,49.53 24.39,49.02 USBC.B9 | 18.04,39.43 S4.1 16.42,39.17 16.42,38.6 v16.26,38.43 16.26,37.32 R14.2 16,37.23
  Top 0.813: 21.84,49.53 v22.4,49.53
  Top 1.016: 12.29,37.08 12.19,37.18 | 21.22,45.2 20.9,44.88 v20.7,44.88 | 21.22,45.2 v21.22,45.49 | v20.7,44.88 21.02,45.2 21.22,45.2 | v20.7,44.88 20.7,44.68 20.37,44.35 20.22,44.2 20.22,44.4 v20.7,44.88
  Top 1.27: 12.29,37.08 C21.2 14.18,37.07 R14.2 | 20.37,44.35 20.37,41.58 18.14,39.35 D5.A 18.04,39.43
  Top 1.524: D5.A 16,37.23
  Bottom 0.406: v4.83,34.67 5.13,34.67 6.1,35.64 6.1,36.32 12.45,42.67 14.99,42.67 16.26,41.4 v16.26,38.43
  Bottom 0.813: v20.7,44.88 21.31,45.49 | 21.31,45.49 21.39,45.57 21.51,45.57 22.86,46.91 22.86,49.53 | 22.86,49.53 v23.37,49.53 v22.4,49.53 22.86,49.53 | v21.22,45.49 21.31,45.49
  Bottom 1.016: v21.22,45.49 21.22,45.4 v20.7,44.88
VBATT_MEASURE  (via drill 0.3)
  Top 0.406: v44.78,37.54 41.43,37.54 39.45,39.52 R5.1 R4.2 | U1.19 44.83,33.97 44.76,34.04 v44.77,34.05
  Bottom 0.406: v44.77,34.05 v44.77,37.53 v44.78,37.54
VBOOST  (via drill 0.3)
  Top 0.61: 5.99,22.89 5.98,22.87 R33.1
  Top 1.016: D31.C 8.74,22.2 v9.22,21.72 | v9.22,21.72 8.26,21.72 v8.18,21.79 8.13,21.84 7.54,21.84 v7.29,21.59 5.99,22.89 | v9.22,21.72 9.22,23.19 9.4,23.37 8.82,23.37 8.34,22.89
  Top 1.473: R33.1 1.79,22.87 1.78,22.86 1.78,14.69 D41.C | 1.95,13.83 C41.2 1.93,11.97 1.93,9.17 E-FUSE-SWITCH.1
  Top 1.524: D31.C 8.34,22.89 5.99,22.89 C6.2 5.88,22.87 R33.1 | D41.C 1.95,13.83
  Bottom 0.508: 12.42,22.05 14.86,22.05 R35.2
  Bottom 1.524: VBOOST.P$1 25.53,27.94 24.82,28.65 19.02,28.65 12.42,22.05 10.46,22.05 10.41,22.1 9.6,22.1 v9.22,21.72 8.97,21.97 8.36,21.97 v8.18,21.79 7.49,21.79 v7.29,21.59
VBOOST2
  Top 0.406: R46.2 7.13,6.44 5.84,6.44
  Top 0.508: 7.87,7.87 7.61,7.87 IC4-E-FUSE.4 6.18,6.44 R41.2
  Top 1.016: R41.2 5.84,6.44
  Top 1.27: E-FUSE-SWITCH.2 2.29,6.27 2.29,5.59 6.1,5.59 6.1,6.19 5.84,6.44
  pour Top (no thermals): 6.86,8.13 8.36,8.13 8.36,5.13 8.23,5 0.28,5 0.28,6.6 1.85,6.6 2.57,5.89 5.13,5.77 6.88,7.52 6.86,7.52
VBOOST-6V  (3 unrouted)
VBOOST-6V-  (via drill 0.3)
  Top 0.61: IC5-5V.3 24.82,31.82 25.09,31.55 v25.17,31.55 | IC5-5V.1 22.37,30.2 C51.2 | C51.2 22.22,30.72 v21.46,31.47 21.64,31.29 21.64,30.62 C51.2
  Top 1.016: C51.2 20.72,30.05 D53.K 20.01,26.93 5V-SWITCH.2
  Bottom 0.61: v25.17,31.55 21.54,31.55 v21.46,31.47
VDD
  Top 0.61: C1.1 8.06,49.6 7.37,48.91 IC1-BATT-PROTECT.6
  Top 0.813: R1.1 8.25,49.67 C1.1
VIN  (via drill 0.3, 0.35)  (4 unrouted)
  Top 0.406: v16.56,32 16.05,32 15.8,31.75 15.8,28.93 17.55,27.18 17.55,26.47 19.36,24.66 19.91,24.66 20.95,23.62 v20.95,18.85 | R4.1 33.27,41.15 VIN'.P$1 | R48.2 25.96,17.4 v25.93,17.42 | v2.95,24.23 2.95,24.63 R3.2 | v10.67,30.38 9.68,31.37 9.5,31.37
  Top 0.508: VIN.P$1 VIN'.P$1
  Top 0.61: C31.2 9.4,31.06 8.71,30.38 IC3.5 9,28.88 9.42,28.88 9.71,29.16 IC3.4 9.61,29.16
  Top 0.762: 9.61,29.16 9.5,29.28
  Top 1.016: v16.56,32 16.59,32 | 15.04,32 L31.P$1 | D5.C 17.8,41.33 S4.2 16.83,41.33 17.7,42.2 v17.7,42.93 | D5.C 18.54,42.07 v18.54,42.93 | v18.54,42.93 18.59,42.98 18.11,43.46 v18.11,43.64 18.11,43.33 v17.7,42.93 | v18.54,42.93 v17.7,42.93 | v17.7,42.93 18.12,42.51 D5.C
  Top 1.27: 16.59,32 v16.59,32.97 15.19,32.97 L31.P$1 13.95,31.73 9.65,31.73 C31.2 9.5,31.37 9.5,29.28 | v16.56,32 15.04,32
  Bottom 0.406: v25.93,17.42 22.45,17.42 21.03,18.85 v20.95,18.85 | v10.67,30.38 7.52,30.38 7.01,29.87 5.89,29.87 4.83,28.8 4.83,27.03 3.23,25.43
  Bottom 0.508: 3.23,25.43 3.23,24.51 v2.95,24.23 | VIN.P$1 VIN'.P$1
  Bottom 1.016: v16.59,32.97 16.59,32 v16.56,32 16.51,32 16,32.51 16,32.94 | v16.59,32.97 16.59,33.53 | 16.46,32.97 v16.59,32.97 | v16.59,32.97 17.02,32.54 | 17.02,32.54 17.02,32.44 | 17.02,32.54 17.02,33.1 | v18.54,42.93 18.11,43.36 v18.11,43.64 | v18.11,43.64 18.11,43.33 v17.7,42.93 18.16,42.93 18.54,42.55 v18.54,42.93 | v18.11,43.64 18.54,43.2 v18.54,42.93
  Bottom 1.27: 16.59,33.53 16.59,34.95 | 16,32.51 16.46,32.97 | 17.02,32.44 16.59,32 | 17.02,33.1 16.59,33.53 | 16,32.94 16.59,33.53
  Bottom 1.524: 16.59,34.95 16.59,35.64 18.54,37.59 18.54,40.64 | 18.54,40.64 18.54,42.55 | VIN.P$1 18.54,40.64
VOUT  (2 unrouted)
VOUT_I  (5 unrouted)
  Top 1.016: 24.11,18.59 24.38,18.87 24.38,25.09
  Top 1.524: C43.1 24.11,18.59 24.11,19.3 25.12,20.32
  pour Top (no thermals): 12.27,8.13 12.27,7.06 16.3,7.06 17.91,5.46 25.4,5.46 25.4,8.13
VREF_2.5V  (via drill 0.3)
  Top 0.406: R27.2 62.48,31.44 64.33,29.59 VREF_SHUNT.1 63.83,28.77 v63.83,27.84 | U1.28 50.15,27.38 50.67,26.85 51,26.85 52.5,25.35 v52.5,25.25
  Bottom 0.406: v52.5,25.25 53.92,26.67 62.66,26.67 v63.83,27.84
XTAL1
  Top 0.406: 62.28,42.42 20MHZ.2
  Top 0.508: 20MHZ.2 62.28,44.34 C3.2 | U1.7 55.85,34.77 62.28,41.2 62.28,42.42
XTAL2
  Top 0.508: C7.2 57.4,44.82 20MHZ.1 57.4,38.25 U1.8

## Text on the board
tPlace: SW OFF ON | LIPO / CHARGE BOOST / PROTECT | VBOOST | 3.3V-17V | 5.5V | 3.3V-17V | 0.5A 1.6A | VOUT / 3V-16V | TRANSISTOR COMPONENT TESTER | TEST / BUTTON
bPlace: TS | v1